# EAGLE schematic octanis_v0.5 (EAGLE 7.2.0)
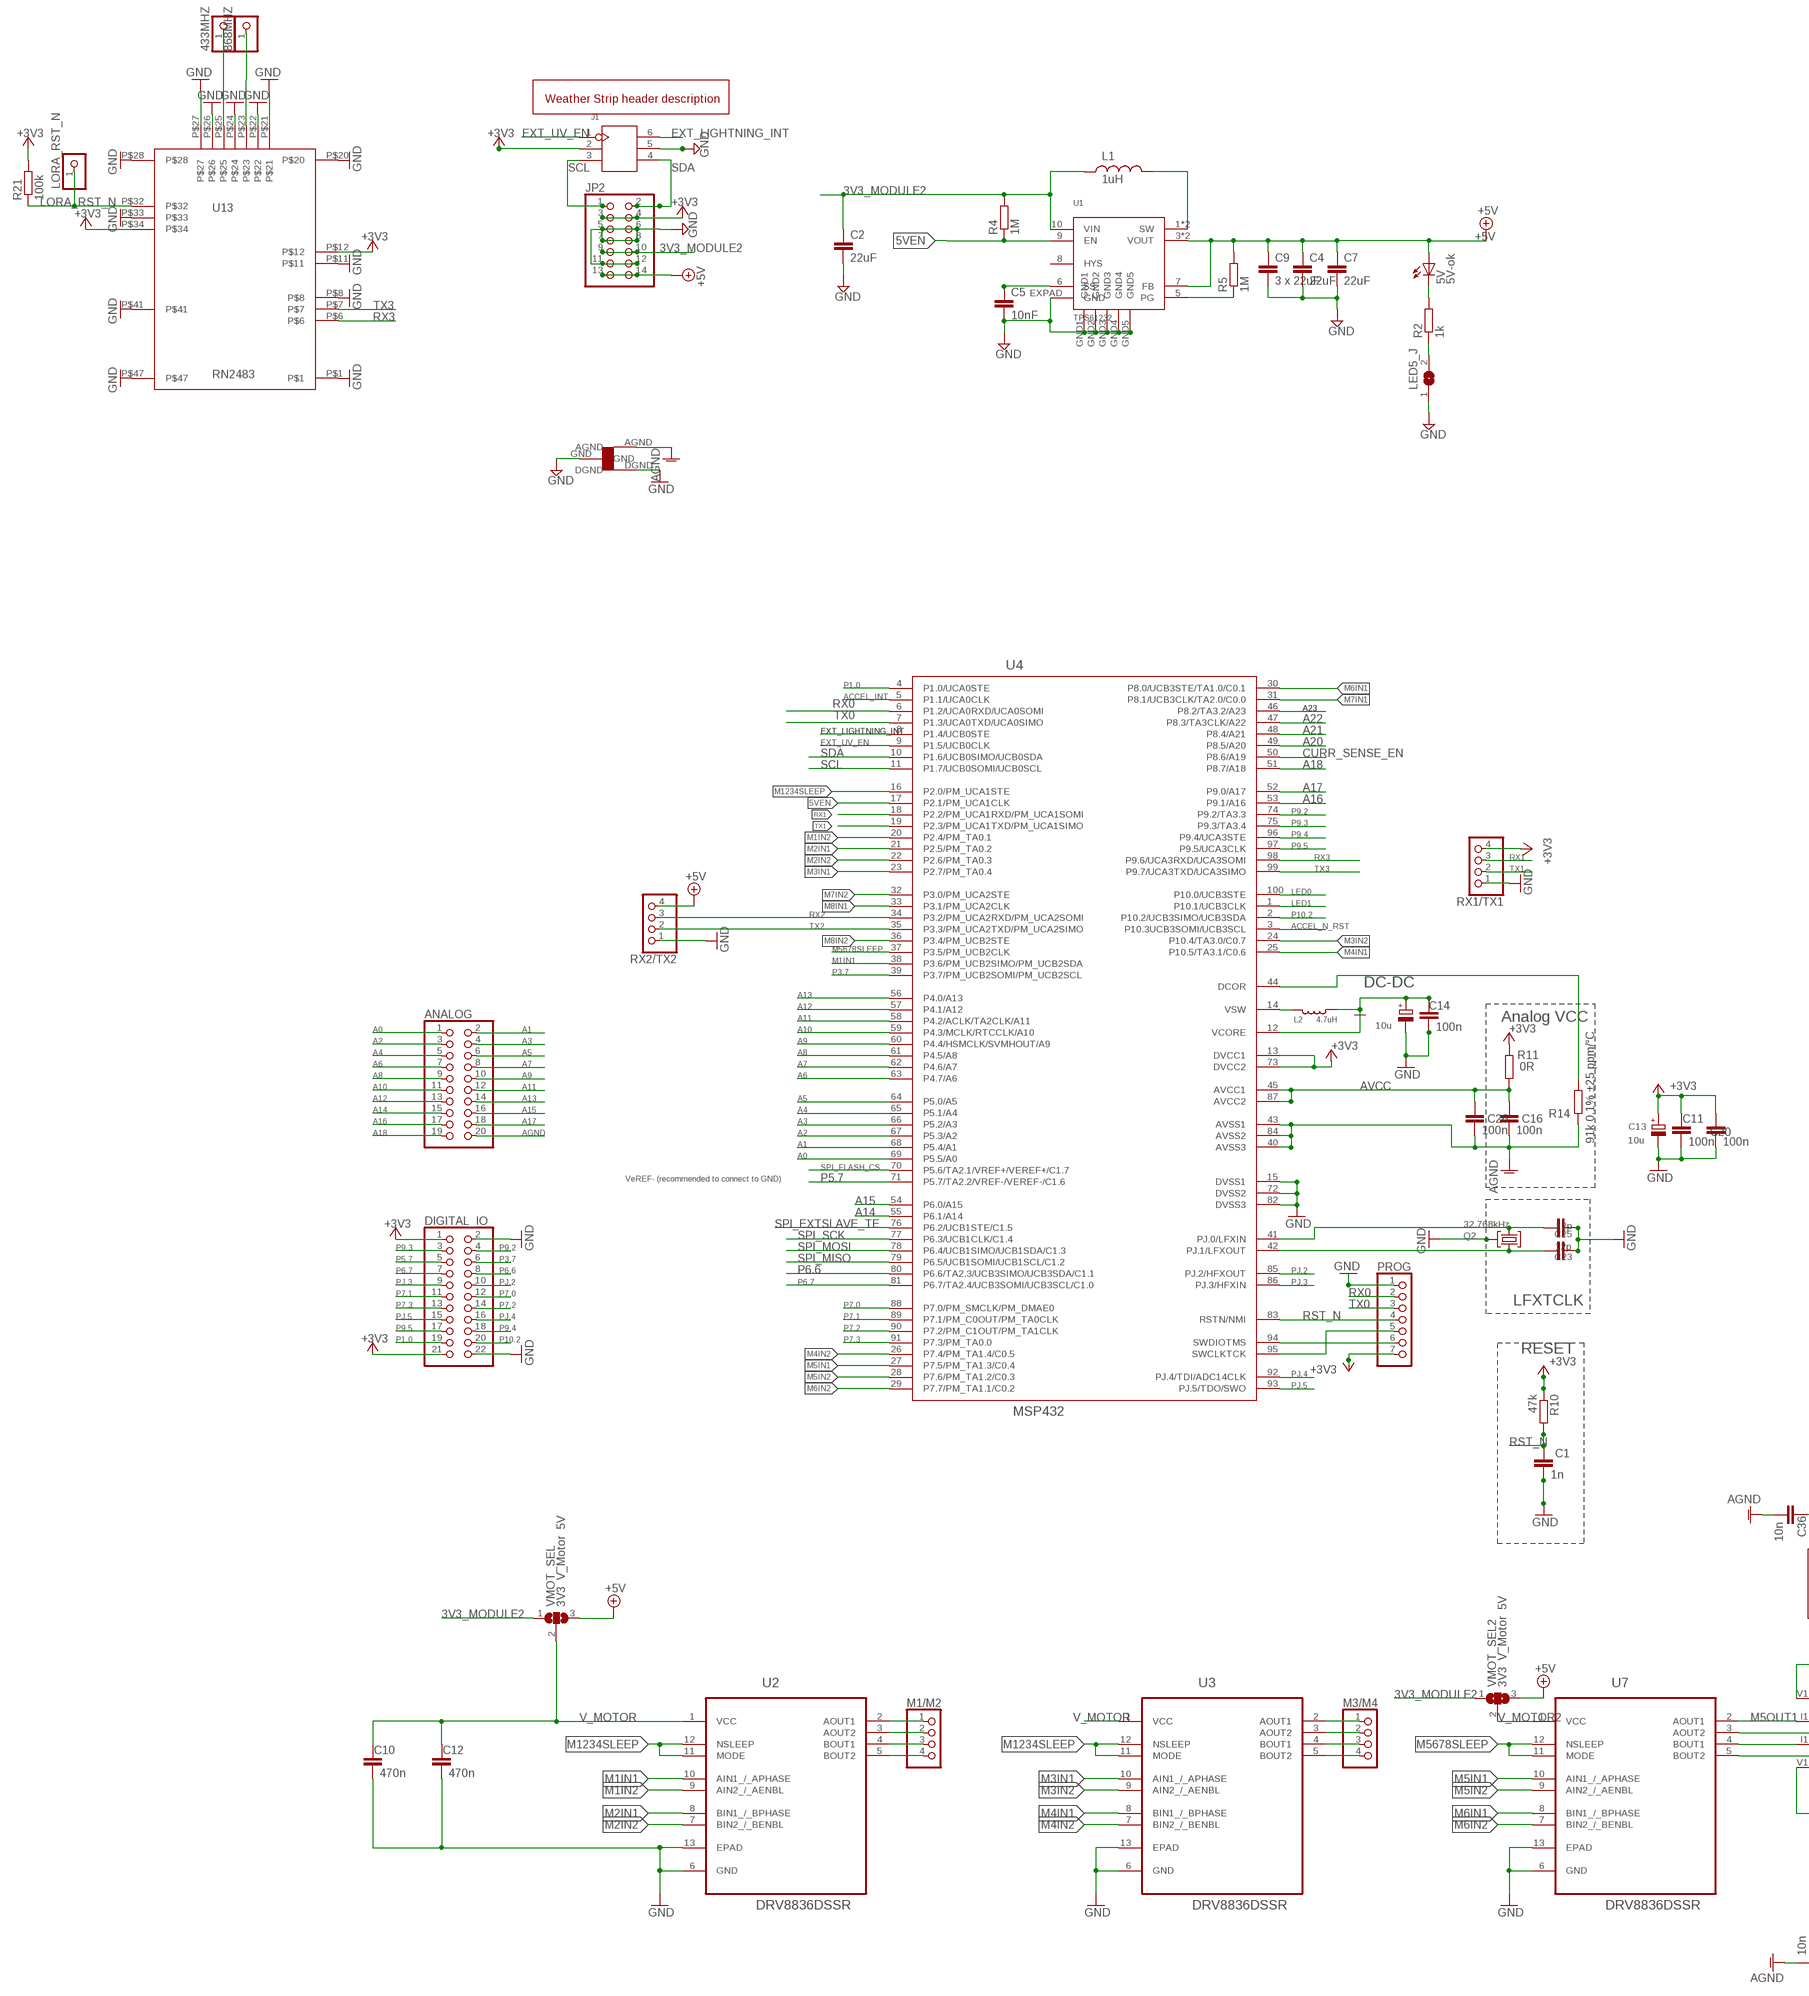
[diagram p0: schematic, sheet 1, part 1 of 2]
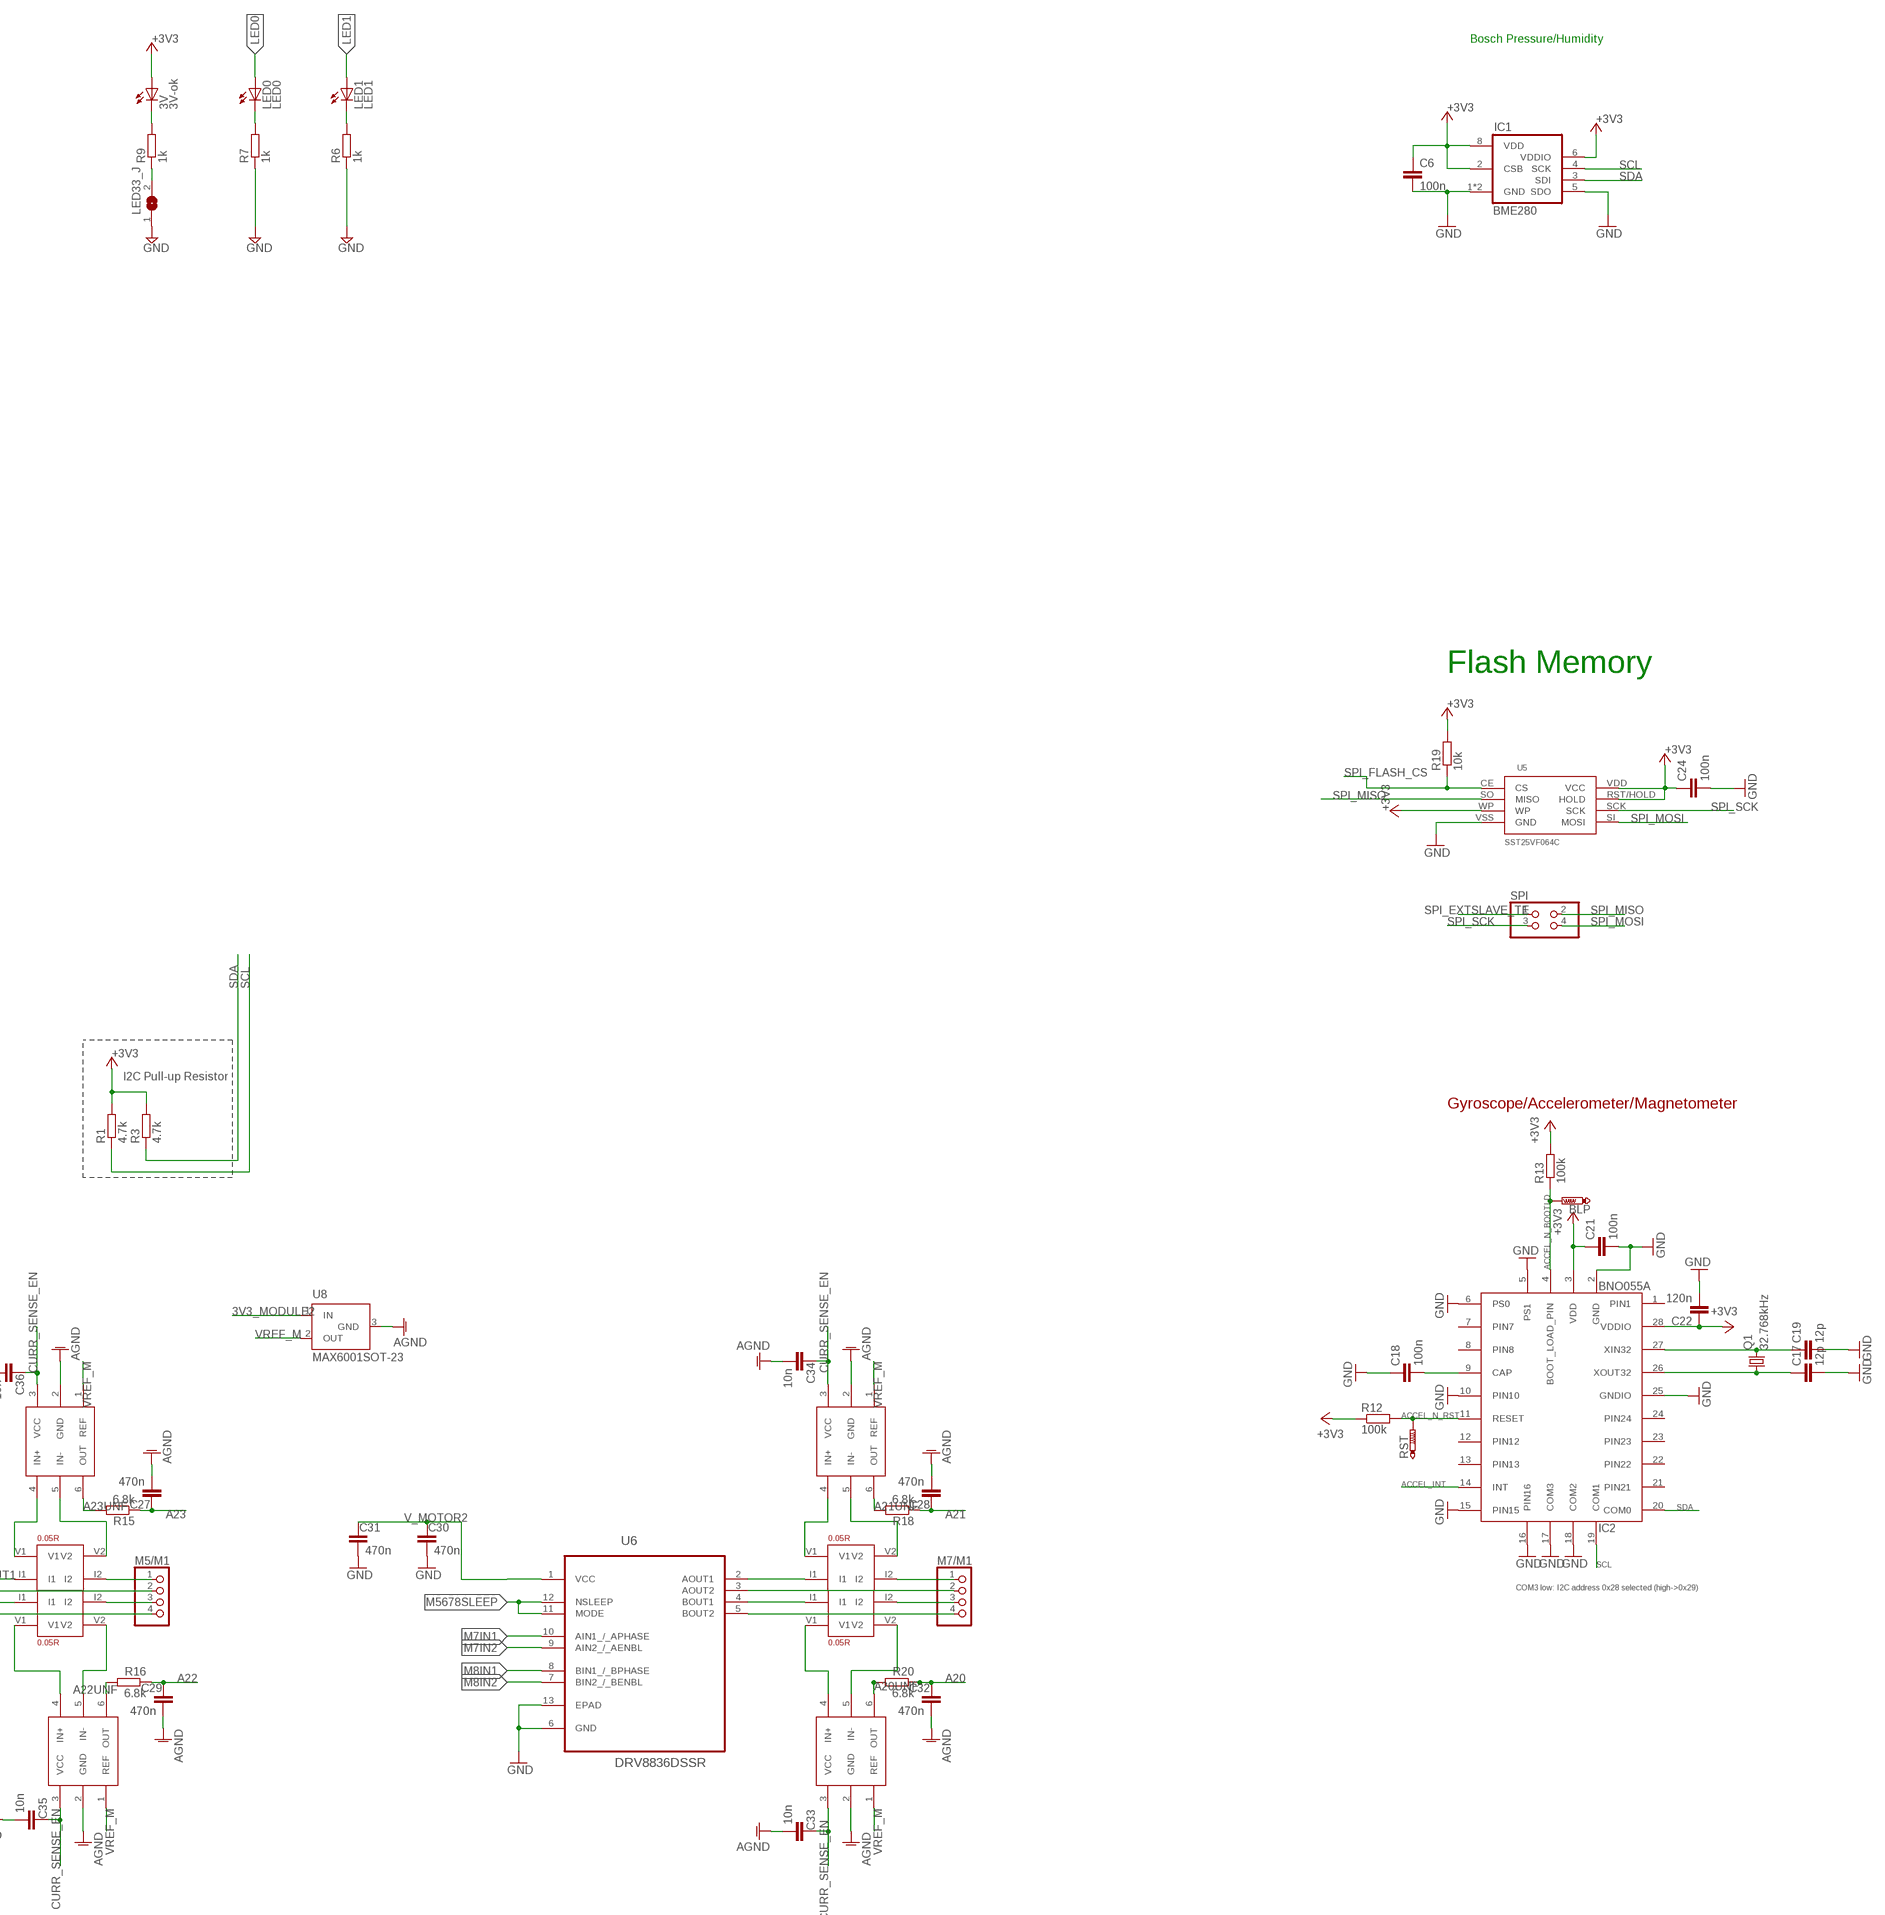
[diagram p1: schematic, sheet 1, part 2 of 2]

## Parts
3V  3V-ok  LEDCHIPLED_0603  [CHIPLED_0603]
5V  5V-ok  LEDCHIPLED_0603  [CHIPLED_0603]
433MHZ  PINHD-1X1  [1X01]
868MHZ  PINHD-1X1  [1X01]
ANALOG  PINHD-2X10  [2X10]
BLP  PTR1B1,27  [B1,27]
C1  1n  C-EUC0603  [C0603]
C2  22uF  C-EUC0603  [C0603]
C4  22uF  C-EUC0603  [C0603]
C5  10nF  C-EUC0603  [C0603]
C6  100n  C-EUC0603  [C0603]
C7  22uF  C-EUC0603  [C0603]
C9  3 x 22uF  C-EUC0603  [C0603]
C10  470n  C-EUC0603  [C0603]
C11  100n  C-EUC0603  [C0603]
C12  470n  C-EUC0603  [C0603]
C13  10u  CPOL-EUA/3216-18R  [A/3216-18R]
C14  100n  C-EUC0603  [C0603]
C15  10u  CPOL-EUA/3216-18R  [A/3216-18R]
C16  100n  C-EUC0402  [C0402]
C17  12p  C-EUC0603  [C0603]
C18  100n  C-EUC0603  [C0603]
C19  12p  C-EUC0603  [C0603]
C20  100n  C-EUC0603  [C0603]
C21  100n  C-EUC0603  [C0603]
C22  120n  C-EUC0603  [C0603]
C23  12p  C-EUC0402  [C0402]
C24  100n  C-EUC0603  [C0603]
C25  12p  C-EUC0402  [C0402]
C26  100n  C-EUC0402  [C0402]
C27  470n  C-EUC0603  [C0603]
C28  470n  C-EUC0603  [C0603]
C29  470n  C-EUC0603  [C0603]
C30  470n  C-EUC0603  [C0603]
C31  470n  C-EUC0603  [C0603]
C32  470n  C-EUC0603  [C0603]
C33  10n  C-EUC0603  [C0603]
C34  10n  C-EUC0603  [C0603]
C35  10n  C-EUC0603  [C0603]
C36  10n  C-EUC0603  [C0603]
DIGITAL_IO  PINHD-2X11  [2X11]
IC1  BME280  [BME280]
IC2  BNO055A  [BNO055]
J1  SMD-BLUE-FEMALE-HEADER-VERT(2X3P-2.54)  [H2X3-SMD-2.54]
JP2  PINHD-2X7  [2X07]
L1  1uH  XFL4020  [XFL4020]
L2  4.7uH  LQM2MP_G0  [0806]
LED0  LED0  LEDCHIPLED_0603  [CHIPLED_0603]
LED1  LED1  LEDCHIPLED_0603  [CHIPLED_0603]
LED5_J  SJ  [SJ]
LED33_J  SJ  [SJ]
LORA_RST_N  PINHD-1X1  [1X01]
M1/M2  PINHD-1X04_2.54-S  [1X04-S]
M3/M4  PINHD-1X04_2.54-S  [1X04-S]
M5/M1  PINHD-1X04_2.54-S  [1X04-S]
M7/M1  PINHD-1X04_2.54-S  [1X04-S]
PROG  PINHD-1X72MM_SMD  [1X7SMD]
Q1  32.768kHz  FC-12M  [FC-12M]
Q2  32.768kHz  MS3V-T1R  [MS3V-T1R]
R1  4.7k  R-EU_R0603  [R0603]
R2  1k  R-EU_R0603  [R0603]
R3  4.7k  R-EU_R0603  [R0603]
R4  1M  R-EU_R0603  [R0603]
R5  1M  R-EU_R0603  [R0603]
R6  1k  R-EU_R0603  [R0603]
R7  1k  R-EU_R0603  [R0603]
R9  1k  R-EU_R0603  [R0603]
R10  47k  R-EU_R0603  [R0603]
R11  0R  R-EU_R0402  [R0402]
R12  100k  R-EU_R0603  [R0603]
R13  100k  R-EU_R0603  [R0603]
R14  91k 0.1% ±25 ppm/°C  R-EU_R0402  [R0402]
R15  6.8k  R-EU_R0603  [R0603]
R16  6.8k  R-EU_R0603  [R0603]
R18  6.8k  R-EU_R0603  [R0603]
R19  10k  R-EU_R0603  [R0603]
R20  6.8k  R-EU_R0603  [R0603]
R21  100k  R-EU_R0603  [R0603]
RS1  0.05R  CURRENT_RESISTOR  [4PADS_RESISTOR]
RS2  0.05R  CURRENT_RESISTOR  [4PADS_RESISTOR]
RS3  0.05R  CURRENT_RESISTOR  [4PADS_RESISTOR]
RS4  0.05R  CURRENT_RESISTOR  [4PADS_RESISTOR]
RST  PTR1B1,27  [B1,27]
RX1/TX1  PINHD-1X04_2.54-S  [1X04-S]
RX2/TX2  PINHD-1X04_2.54-S  [1X04-S]
SPI  PINHD-2X2  [2X02]
U1  TPS61232  [S-PVSON-N10]
U2  DRV8836DSSR  [SON50P200X300X80-13N]
U3  DRV8836DSSR  [SON50P200X300X80-13N]
U4  MSP432  [PZ100]
U5  SST25VF064C  [SOIC_8-LEAD]
U6  DRV8836DSSR  [SON50P200X300X80-13N]
U7  DRV8836DSSR  [SON50P200X300X80-13N]
U8  MAX6001SOT-23  [MAX6001]
U9  INA210  INA213  [SC70-6]
U10  INA210  INA213  [SC70-6]
U11  INA210  INA213  [SC70-6]
U12  INA210  INA213  [SC70-6]
U13  RN2483  [RN2483]
U$1  WEATHER_STRIP_DOCU  [WEATHER_STRIP_DOCU]
U$100  STARGND  [STAR]
VMOT_SEL  3V3 V_Motor 5V  SJ2W  [SJ_2]
VMOT_SEL2  3V3 V_Motor 5V  SJ2W  [SJ_2]

## Nets
3V3_MODULE2 [power]: C2.1 JP2.9 JP2.10 L1.P$1 R4.2 U1.10(VIN) U8.1(IN) VMOT_SEL2.1 VMOT_SEL.1
5VEN: R4.1 U1.9(EN) U4.17(P2.1/PM_UCA1CLK)
+3V3 [power]: 3V.A C6.1 C11.2 C13.+ C20.2 C21.1 C22.1 C24.1 DIGITAL_IO.1 DIGITAL_IO.21 IC1.2(CSB) IC1.6(VDDIO) IC1.8(VDD) IC2.3(VDD) IC2.28(VDDIO) J1.2 JP2.3 JP2.4 PROG.7 R1.2 R3.2 R10.1 R11.2 R12.1 R13.2 R19.2 R21.2 RX1/TX1.4 U4.13(DVCC1) U4.73(DVCC2) U5.RST/HOLD(HOLD) U5.VDD(VCC) U5.WP U13.P$12 U13.P$34
+5V [fine]: 5V.A C4.1 C7.1 C9.1 JP2.13 JP2.14 R5.2 RX2/TX2.4 U1.3(VOUT) U1.4(VOUT) U1.7(FB) VMOT_SEL2.3 VMOT_SEL.3
A0: ANALOG.1 U4.69(P5.5/A0)
A1: ANALOG.2 U4.68(P5.4/A1)
A2: ANALOG.3 U4.67(P5.3/A2)
A3: ANALOG.4 U4.66(P5.2/A3)
A4: ANALOG.5 U4.65(P5.1/A4)
A5: ANALOG.6 U4.64(P5.0/A5)
A6: ANALOG.7 U4.63(P4.7/A6)
A7: ANALOG.8 U4.62(P4.6/A7)
A8: ANALOG.9 U4.61(P4.5/A8)
A9: ANALOG.10 U4.60(P4.4/HSMCLK/SVMHOUT/A9)
A10: ANALOG.11 U4.59(P4.3/MCLK/RTCCLK/A10)
A11: ANALOG.12 U4.58(P4.2/ACLK/TA2CLK/A11)
A12: ANALOG.13 U4.57(P4.1/A12)
A13: ANALOG.14 U4.56(P4.0/A13)
A14: ANALOG.15 U4.55(P6.1/A14)
A15: ANALOG.16 U4.54(P6.0/A15)
A16: ANALOG.17 U4.53(P9.1/A16)
A17: ANALOG.18 U4.52(P9.0/A17)
A18: ANALOG.19 U4.51(P8.7/A18)
A20: C32.2 R20.1 U4.49(P8.5/A20)
A20UNF: R20.2 U9.6(OUT)
A21: C28.2 R18.1 U4.48(P8.4/A21)
A21UNF: R18.2 U10.6(OUT)
A22: C29.2 R16.1 U4.47(P8.3/TA3CLK/A22)
A22UNF: R16.2 U11.6(OUT)
A23: C27.2 R15.1 U4.46(P8.2/TA3.2/A23)
A23UNF: R15.2 U12.6(OUT)
ACCEL_INT: IC2.14(INT) U4.5(P1.1/UCA0CLK)
ACCEL_N_BOOTLD: BLP.TP IC2.4(BOOT_LOAD_PIN) R13.1
ACCEL_N_RST: IC2.11(RESET) R12.2 RST.TP U4.3(P10.3UCB3SOMI/UCB3SCL)
AGND [power]: ANALOG.20 C16.2 C26.2 C27.1 C28.1 C29.1 C32.1 C33.1 C34.1 C35.1 C36.1 R14.2 U4.40(AVSS3) U4.43(AVSS1) U4.84(AVSS2) U8.3(GND) U9.2(GND) U10.2(GND) U11.2(GND) U12.2(GND) U$100.AGND
ANT433: 433MHZ.1 U13.P$25
ANT868: 868MHZ.1 U13.P$23
AVCC [VIN]: C16.1 C26.1 R11.1 U4.45(AVCC1) U4.87(AVCC2)
CURR_SENSE_EN [VIN]: C33.2 C34.2 C35.2 C36.2 U4.50(P8.6/A19) U9.3(VCC) U10.3(VCC) U11.3(VCC) U12.3(VCC)
EXT_LIGHTNING_INT: J1.6 U4.8(P1.4/UCB0STE)
EXT_UV_EN: J1.1 U4.9(P1.5/UCB0CLK)
GND [power]: C1.1 C2.2 C4.2 C5.2 C6.2 C7.2 C9.2 C10.1 C11.1 C12.1 C13.- C14.1 C15.- C17.2 C18.1 C19.2 C20.1 C21.2 C22.2 C23.1 C24.2 C25.1 C30.1 C31.1 DIGITAL_IO.2 DIGITAL_IO.22 IC1.1(GND) IC1.5(SDO) IC1.7(GND) IC2.2(GND) IC2.5(PS1) IC2.6(PS0) IC2.10(PIN10) IC2.15(PIN15) IC2.16(PIN16) IC2.17(COM3) IC2.18(COM2) IC2.25(GNDIO) J1.5 JP2.5 JP2.6 JP2.7 JP2.8 JP2.11 JP2.12 LED5_J.1 LED33_J.1 PROG.1 Q2.P3(GND) R6.1 R7.1 RX1/TX1.1 RX2/TX2.1 U1.EXPAD(GND) U1.GND1 U1.GND2 U1.GND3 U1.GND4 U1.GND5 U2.6(GND) U2.13(EPAD) U3.6(GND) U3.13(EPAD) U4.15(DVSS1) U4.72(DVSS2) U4.82(DVSS3) U5.VSS(GND) U6.6(GND) U6.13(EPAD) U7.6(GND) U7.13(EPAD) U13.P$1 U13.P$8 U13.P$11 U13.P$20 U13.P$21 U13.P$22 U13.P$24 U13.P$26 U13.P$27 U13.P$28 U13.P$33 U13.P$41 U13.P$47 U$100.DGND U$100.GND
IND: L1.P$2 U1.1(SW) U1.2(SW)
LED0: LED0.A U4.100(P10.0/UCB3STE)
LED1: LED1.A U4.1(P10.1/UCB3CLK)
LORA_RST_N: LORA_RST_N.1 R21.1 U13.P$32
M1IN1: U2.10(AIN1_/_APHASE) U4.38(P3.6/PM_UCB2SIMO/PM_UCB2SDA)
M1IN2: U2.9(AIN2_/_AENBL) U4.20(P2.4/PM_TA0.1)
M2IN1: U2.8(BIN1_/_BPHASE) U4.21(P2.5/PM_TA0.2)
M2IN2: U2.7(BIN2_/_BENBL) U4.22(P2.6/PM_TA0.3)
M3IN1: U3.10(AIN1_/_APHASE) U4.23(P2.7/PM_TA0.4)
M3IN2: U3.9(AIN2_/_AENBL) U4.24(P10.4/TA3.0/C0.7)
M4IN1: U3.8(BIN1_/_BPHASE) U4.25(P10.5/TA3.1/C0.6)
M4IN2: U3.7(BIN2_/_BENBL) U4.26(P7.4/PM_TA1.4/C0.5)
M5IN1: U4.27(P7.5/PM_TA1.3/C0.4) U7.10(AIN1_/_APHASE)
M5IN2: U4.28(P7.6/PM_TA1.2/C0.3) U7.9(AIN2_/_AENBL)
M5OUT1: RS4.I1 U7.2(AOUT1)
M6IN1: U4.30(P8.0/UCB3STE/TA1.0/C0.1) U7.8(BIN1_/_BPHASE)
M6IN2: U4.29(P7.7/PM_TA1.1/C0.2) U7.7(BIN2_/_BENBL)
M7IN1: U4.31(P8.1/UCB3CLK/TA2.0/C0.0) U6.10(AIN1_/_APHASE)
M7IN2: U4.32(P3.0/PM_UCA2STE) U6.9(AIN2_/_AENBL)
M8IN1: U4.33(P3.1/PM_UCA2CLK) U6.8(BIN1_/_BPHASE)
M8IN2: U4.36(P3.4/PM_UCB2STE) U6.7(BIN2_/_BENBL)
M1234SLEEP: U2.11(MODE) U2.12(NSLEEP) U3.11(MODE) U3.12(NSLEEP) U4.16(P2.0/PM_UCA1STE)
M5678SLEEP: U4.37(P3.5/PM_UCB2CLK) U6.11(MODE) U6.12(NSLEEP) U7.11(MODE) U7.12(NSLEEP)
N$1: C14.2 C15.+ L2.1 U4.12(VCORE)
N$2: R5.1 U1.5(PG)
N$4: 3V.C R9.2
N$5: LED0.C R7.2
N$6: LED1.C R6.2
N$8: C23.2 Q2.P2 U4.41(PJ.0/LFXIN)
N$10: C25.2 Q2.P1 U4.42(PJ.1/LFXOUT)
N$13: M3/M4.1 U3.2(AOUT1)
N$14: LED5_J.2 R2.1
N$15: RS4.V2 U12.5(IN-)
N$17: RS4.V1 U12.4(IN+)
N$18: C18.2 IC2.9(CAP)
N$19: C19.1 IC2.27(XIN32) Q1.2
N$21: M5/M1.1 RS4.I2
N$23: RS3.V1 U11.4(IN+)
N$24: RS3.V2 U11.5(IN-)
N$25: RS3.I1 U7.4(BOUT1)
N$26: LED33_J.2 R9.1
N$27: M5/M1.3 RS3.I2
N$28: RS2.V2 U10.5(IN-)
N$29: RS2.V1 U10.4(IN+)
N$30: RS1.V2 U9.5(IN-)
N$31: RS1.V1 U9.4(IN+)
N$32: M7/M1.1 RS2.I2
N$33: R14.1 U4.44(DCOR)
N$34: L2.2 U4.14(VSW)
N$35: RS1.I1 U6.4(BOUT1)
N$36: RS2.I1 U6.2(AOUT1)
N$37: M7/M1.3 RS1.I2
N$38: M5/M1.2 U7.3(AOUT2)
N$39: M3/M4.2 U3.3(AOUT2)
N$40: M3/M4.3 U3.4(BOUT1)
N$41: M3/M4.4 U3.5(BOUT2)
N$42: C5.1 U1.6(SS)
N$43: M5/M1.4 U7.5(BOUT2)
N$44: 5V.C R2.2
N$45: M7/M1.4 U6.5(BOUT2)
N$49: M1/M2.1 U2.2(AOUT1)
N$50: M1/M2.2 U2.3(AOUT2)
N$51: M1/M2.3 U2.4(BOUT1)
N$52: M1/M2.4 U2.5(BOUT2)
N$54: M7/M1.2 U6.3(AOUT2)
N$73: C17.1 IC2.26(XOUT32) Q1.1
N$76: PROG.6 U4.94(SWDIOTMS)
N$77: PROG.5 U4.95(SWCLKTCK)
P1.0: DIGITAL_IO.19 U4.4(P1.0/UCA0STE)
P3.7: DIGITAL_IO.6 U4.39(P3.7/PM_UCB2SOMI/PM_UCB2SCL)
P5.7 [power]: DIGITAL_IO.5 U4.71(P5.7/TA2.2/VREF-/VEREF-/C1.6)
P6.6: DIGITAL_IO.8 U4.80(P6.6/TA2.3/UCB3SIMO/UCB3SDA/C1.1)
P6.7: DIGITAL_IO.7 U4.81(P6.7/TA2.4/UCB3SOMI/UCB3SCL/C1.0)
P7.0: DIGITAL_IO.12 U4.88(P7.0/PM_SMCLK/PM_DMAE0)
P7.1: DIGITAL_IO.11 U4.89(P7.1/PM_C0OUT/PM_TA0CLK)
P7.2: DIGITAL_IO.14 U4.90(P7.2/PM_C1OUT/PM_TA1CLK)
P7.3: DIGITAL_IO.13 U4.91(P7.3/PM_TA0.0)
P9.2: DIGITAL_IO.4 U4.74(P9.2/TA3.3)
P9.3: DIGITAL_IO.3 U4.75(P9.3/TA3.4)
P9.4: DIGITAL_IO.18 U4.96(P9.4/UCA3STE)
P9.5: DIGITAL_IO.17 U4.97(P9.5/UCA3CLK)
P10.2: DIGITAL_IO.20 U4.2(P10.2/UCB3SIMO/UCB3SDA)
PJ.2: DIGITAL_IO.10 U4.85(PJ.2/HFXOUT)
PJ.3: DIGITAL_IO.9 U4.86(PJ.3/HFXIN)
PJ.4: DIGITAL_IO.16 U4.92(PJ.4/TDI/ADC14CLK)
PJ.5: DIGITAL_IO.15 U4.93(PJ.5/TDO/SWO)
RST_N: C1.2 PROG.4 R10.2 U4.83(RSTN/NMI)
RX0: PROG.2 U4.6(P1.2/UCA0RXD/UCA0SOMI)
RX1: RX1/TX1.3 U4.18(P2.2/PM_UCA1RXD/PM_UCA1SOMI)
RX2: RX2/TX2.3 U4.34(P3.2/PM_UCA2RXD/PM_UCA2SOMI)
RX3: U4.98(P9.6/UCA3RXD/UCA3SOMI) U13.P$6
SCL: IC1.4(SCK) IC2.19(COM1) J1.3 JP2.1 R1.1 U4.11(P1.7/UCB0SOMI/UCB0SCL)
SDA: IC1.3(SDI) IC2.20(COM0) J1.4 JP2.2 R3.1 U4.10(P1.6/UCB0SIMO/UCB0SDA)
SPI_EXTSLAVE_TE: SPI.1 U4.76(P6.2/UCB1STE/C1.5)
SPI_FLASH_CS: R19.1 U4.70(P5.6/TA2.1/VREF+/VEREF+/C1.7) U5.CE(CS)
SPI_MISO: SPI.2 U4.79(P6.5/UCB1SOMI/UCB1SCL/C1.2) U5.SO(MISO)
SPI_MOSI: SPI.4 U4.78(P6.4/UCB1SIMO/UCB1SDA/C1.3) U5.SI(MOSI)
SPI_SCK: SPI.3 U4.77(P6.3/UCB1CLK/C1.4) U5.SCK
TX0: PROG.3 U4.7(P1.3/UCA0TXD/UCA0SIMO)
TX1: RX1/TX1.2 U4.19(P2.3/PM_UCA1TXD/PM_UCA1SIMO)
TX2: RX2/TX2.2 U4.35(P3.3/PM_UCA2TXD/PM_UCA2SIMO)
TX3: U4.99(P9.7/UCA3TXD/UCA3SIMO) U13.P$7
V_MOTOR [fine]: C10.2 C12.2 U2.1(VCC) U3.1(VCC) VMOT_SEL.2
V_MOTOR2 [fine]: C30.2 C31.2 U6.1(VCC) U7.1(VCC) VMOT_SEL2.2
VREF_M [power]: U8.2(OUT) U9.1(REF) U10.1(REF) U11.1(REF) U12.1(REF)
Unconnected: IC2.1(PIN1) IC2.7(PIN7) IC2.8(PIN8) IC2.12(PIN12) IC2.13(PIN13) IC2.21(PIN21) IC2.22(PIN22) IC2.23(PIN23) IC2.24(PIN24) U1.8(HYS)

## Notes on the sheet
- Bosch Pressure/Humidity
- Flash Memory
- DC-DC
- Analog VCC
- VeREF- (recommended to connect to GND)
- I2C Pull-up Resistor
- Gyroscope/Accelerometer/Magnetometer
- LFXTCLK
- RESET
- COM3 low: I2C address 0x28 selected (high->0x29)

## Library data of the parts
3V 5V LED0 LED1 = adafruit:LED: LED OSRAM: - CHIPLED LG R971, LG N971, LY N971, LG Q971, LY Q971, LO R971, LY R971 LH N974, LH R974 LS Q976, LO Q976, LY Q976 LO Q996 - Hyper CHIPLED LW Q18S LB Q993, LB Q99A, LB R99A - SideLED LS A670, LO A670, LY A670, LG A670, LP A670 LB A673, LV A673, LT A673, LW A673 LH A674 LY A675 LS A676, LA A676, LO A676, LY A676, LW A676 LS A679, LY A679, LG A679 - Hyper Micro SIDELED® LS Y876, LA Y876, LO Y876, LY Y876 LT Y87S - SmartLED LW L88C, LW L88S LB L89C, LB L89S, LG L890 LS L89K, LO L89K, LY L89K LS L896, LA L896, LO L896, LY L896 - TOPLED LS T670, LO T670, LY T670, LG T670, LP T670 LSG T670, LSP T670, LSY T670, LOP T670, LYG T670 LG T671, LOG T671, LSG T671 LB T673, LV T673, LT T673, LW T673 LH T674 LS T676, LA T676, LO T676, LY T676, LB T676, LH T676, LSB T676, LW T676 LB T67C, LV T67C, LT T67C, LS T67K, LO T67K, LY T67K, LW E67C LS E67B, LA E67B, LO E67B, LY E67B, LB E67C, LV E67C, LT E67C LW T67C LS T679, LY T679, LG T679 LS T770, LO T770, LY T770, LG T770, LP T770 LB T773, LV T773, LT T773, LW T773 LH T774 LS E675, LA E675, LY E675, LS T675 LS T776, LA T776, LO T776, LY T776, LB T776 LHGB T686 LT T68C, LB T68C - Hyper Mini TOPLED® LB M676 - Mini TOPLED Santana® LG M470 LS M47K, LO M47K, LY M47K Source: http://www.osram.convergy.de/
433MHZ 868MHZ LORA_RST_N = Headerlibrary:PINHD-1X1: PIN HEADER
ANALOG = pinhead:PINHD-2X10: PIN HEADER
BLP RST = testpad:PTR1: TEST PIN
C1 C2 C4-C7 C9-C12 C14 C16-C36 = rcl:C-EU: CAPACITOR, European symbol
C13 C15 = rcl:CPOL-EU: POLARIZED CAPACITOR, European symbol
DIGITAL_IO = pinhead:PINHD-2X11: PIN HEADER
IC1 = bosch-bme280:BME280: DIGITAL HUMIDITY, PRESSURE AND TEMPERATURE SENSOR * Digital interface I²C (up to 3.4 MHz) and SPI (3 and 4 wire, up to 10 MHz)* Supply voltage VDD main supply voltage range: 1.71 V to 3.6 V*VDDIO interface voltage range: 1.2 V to 3.6 V Operating range -40…+85 °C, 0…100 % rel. humidity, 300…1100 hPa The library has been designed by Richard Magdycz <https://www.facebook.com/groups/eaglecadsoftUK>
IC2 = BNO055:BNO055
J1 = Seeed-OPL-Connector:SMD-BLUE-FEMALE-HEADER-VERT(2X3P-2.54): 320030035; MPN: F185-1203A1BMYA1
JP2 = pinhead:PINHD-2X7: PIN HEADER
L1 = Coilcraft:XFL4020
L2 = Murata:LQM2MP_G0
LED5_J LED33_J = jumper:SJ: SMD solder JUMPER
M1/M2 M3/M4 M5/M1 M7/M1 RX1/TX1 RX2/TX2 = pinhead-2:PINHD-1X04: PIN HEADER
PROG = Headerlibrary:PINHD-1X7: PIN HEADER
Q1 = crystal:FC-12M: kHz RANGE CRYSTAL UNIT LOW PROFILE SMD Source: Epson Toyocom FC-12M.pdf; URL: http://www.mouser.ch/ProductDetail/ECS/ECS-327-125-12-TR/?qs=sGAEpiMZZMsBj6bBr9Q9adKxTNdvE4KvM1b8HDkgjuY%3d
Q2 = microcrystal:MS3V-T1R
R1-R7 R9-R16 R18-R21 = rcl:R-EU_: RESISTOR, European symbol
RS1-RS4 = Octanis1_EPS:CURRENT_RESISTOR
SPI = pinhead:PINHD-2X2: PIN HEADER
U1 = texasinstruments:TPS61232: Up to 96% Efficiency Synchronous Boost Converter 3.3 V to 5 V Power Conversion with 2.1 A Output Current Input Supply Voltage Supervisor with Adjustable Threshold/ Hysteresis Power Save Mode for Light Load Efficiency Load Disconnect During Shutdown Output Over Voltage Protection Programmable Soft Start Power Good Output Input Voltage Range: 2.3 V to 5.5 V Output Voltage Range: 2.5 V to 5.5 V 2 MHz Switching Frequency Output Capacitor Discharge (TPS61231) 3 mm × 3 mm × 0.9 mm SON Package
U2 U3 U6 U7 = DRV8834:DRV8836DSSR: DUAL LOW VOLTAGE H-BRIDGE IC,SON-12; MPN: DRV8836DSSR; OC_FARNELL: 2115236; OC_NEWARK: 94T6066; PACKAGE: SON-12; SUPPLIER: TEXAS INSTRUMENTS
U4 = MSP-EXP432:MSP432
U5 = BertaLib:SST25VF064C
U8 = Octanis1:MAX6001
U9-U12 = Octanis1_EPS:INA213: Voltage Output, High or Low Side Measurement, Bi-Directional Zer ø -Drift Series Current-Shunt Monitor
U13 = Octanis1:RN2483: Microchip Low-Power Long Range LoRaTM Technology Transceiver Module
U$1 = Octanis1:WEATHER_STRIP_DOCU
U$100 = lpatiny:STARGND
VMOT_SEL VMOT_SEL2 = jumper:SJ2W: SMD solder JUMPER

## Net classes
0 default: width 0.203 mm
1 power: width 0.203 mm, drill 0.305 mm, clearance 0.152 mm
2 VIN: width 0.203 mm, drill 0.305 mm, clearance 0.152 mm
3 fine: width 0.406 mm, drill 0.61 mm, clearance 0.152 mm